# EAGLE design Mi2 (EAGLE 7.4.0)
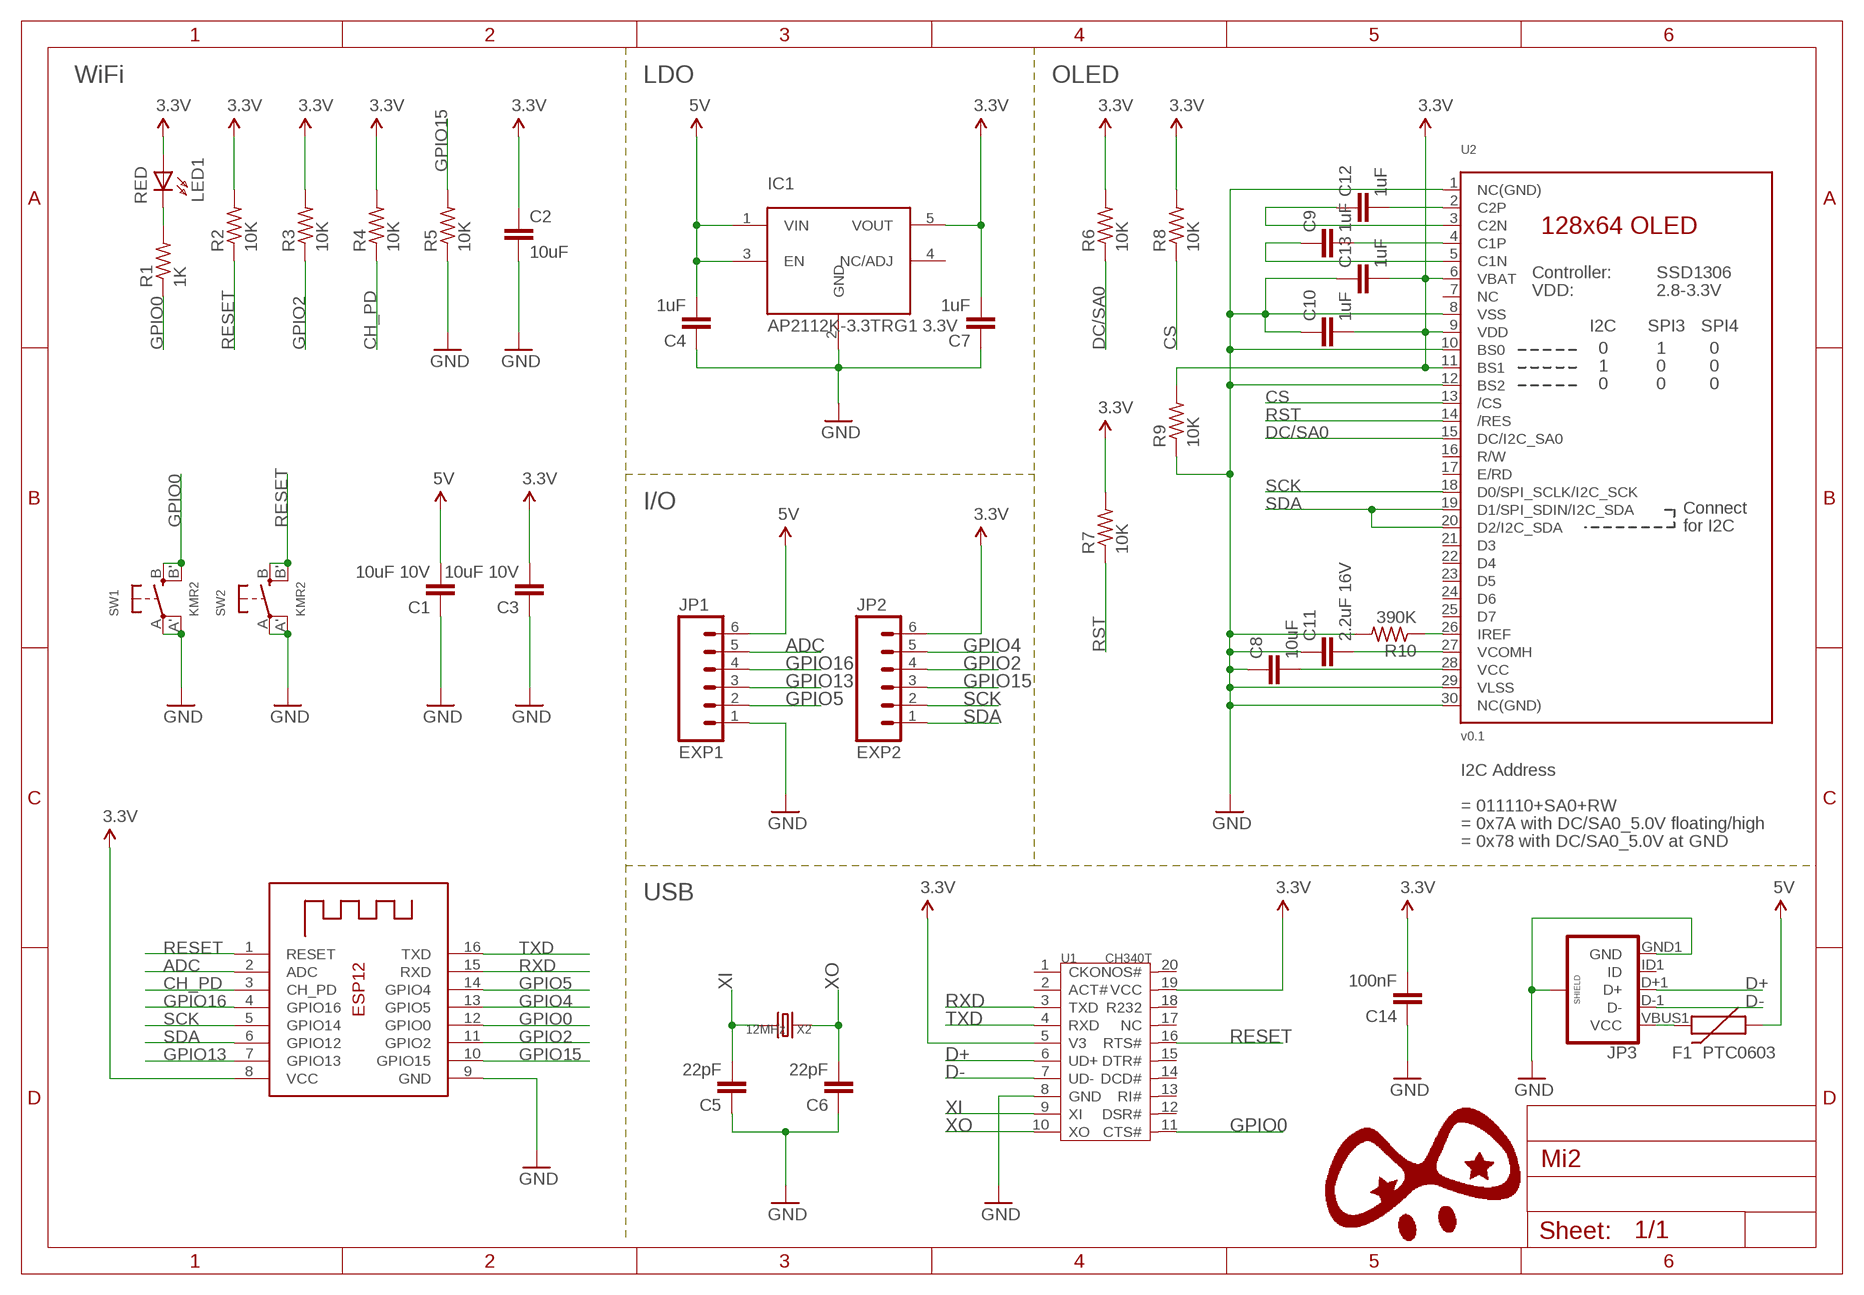
[diagram p0: schematic, sheet 1]

## Parts
C1  10uF 10V  CAP0402-CAP  [0402-CAP]
C2  10uF  10UF-6.3V-20%(0603)  [0603-CAP]
C3  10uF 10V  CAP0402-CAP  [0402-CAP]
C4  1uF  CAP0402-CAP  [0402-CAP]
C5  22pF  CAP0402-CAP  [0402-CAP]
C6  22pF  CAP0402-CAP  [0402-CAP]
C7  1uF  CAP0402-CAP  [0402-CAP]
C8  10uF  10UF-6.3V-20%(0603)  [0603-CAP]
C9  1uF  10UF-6.3V-20%(0603)  [0603-CAP]
C10  1uF  10UF-6.3V-20%(0603)  [0603-CAP]
C11  2.2uF 16V  10UF-6.3V-20%(0603)  [0603-CAP]
C12  1uF  10UF-6.3V-20%(0603)  [0603-CAP]
C13  1uF  10UF-6.3V-20%(0603)  [0603-CAP]
C14  100nF  CAP0402-CAP  [0402-CAP]
F1  PTC0603  [0603]
IC1  AP2112K-3.3TRG1 3.3V  5PIN_REG  [SOT23-5]
JP1  EXP1  M06LOCK  [1X06_LOCK]
JP2  EXP2  M06LOCK  [1X06_LOCK]
JP3  USB_MICROB_PLUGCONN-11752  [USB-B-MICRO-SMD_V03]
LED1  RED  LED0603DWS_L  [LED-0603_L]
R1  1K  R-US_R0402  [R0402]
R2  10K  R-US_R0402  [R0402]
R3  10K  R-US_R0402  [R0402]
R4  10K  R-US_R0402  [R0402]
R5  10K  R-US_R0402  [R0402]
R6  10K  R-US_R0402  [R0402]
R7  10K  R-US_R0402  [R0402]
R8  10K  R-US_R0402  [R0402]
R9  10K  R-US_R0402  [R0402]
R10  390K  R-US_R0402  [R0402]
SW1  KMR2  SWITCH_TACT_SMT4.6X2.8  [BTN_KMR2_4.6X2.8]
SW2  KMR2  SWITCH_TACT_SMT4.6X2.8  [BTN_KMR2_4.6X2.8]
U1  CH340T  [SSOP20]
U2  v0.1  DISP_OLED_UG-2864HSWEG010.96"  [UG-2864HSWEG01_0.96IN_WRAPAROUND]
X1  ESP-12  [ESP-12]
X2  12MHz  CRYSTAL'5032'  [2P-SMD-5X3.2]

## Nets
3.3V: C2.1 C3.2 C7.2 C10.2 C13.2 C14.2 IC1.5(VOUT) JP2.6 LED1.A R2.2 R3.2 R4.2 R6.2 R7.2 R8.2 R9.2 U1.5(V3) U1.19(VCC) U2.6(VBAT) U2.9(VDD) U2.11(BS1) X1.8(VCC)
5V: C1.2 C4.2 F1.1 IC1.1(VIN) IC1.3(EN) JP1.6
ADC: JP1.5 X1.2(ADC)
CH_PD: R4.1 X1.3(CH_PD)
CS: R8.1 U2.13(/CS)
D+: JP3.D+1(D+) U1.6(UD+)
D-: JP3.D-1(D-) U1.7(UD-)
DC/SA0: R6.1 U2.15(DC/I2C_SA0)
GND: C1.1 C2.2 C3.1 C4.1 C5.1 C6.1 C7.1 C8.1 C10.1 C11.1 C13.1 C14.1 IC1.2(GND) JP1.1 JP3.GND1(GND) JP3.SHIELD1(SHIELD) JP3.SHIELD2(SHIELD) JP3.SHIELD3(SHIELD) R5.1 R9.1 R10.2 SW1.A'(P1) SW1.A(P) SW2.A'(P1) SW2.A(P) U1.8(GND) U2.1(NC(GND)) U2.8(VSS) U2.10(BS0) U2.12(BS2) U2.29(VLSS) U2.30(NC(GND)) X1.9(GND)
GPIO0: R1.1 SW1.B'(S1) SW1.B(S) U1.11(CTS#) X1.12(GPIO0)
GPIO2: JP2.4 R3.1 X1.11(GPIO2)
GPIO4: JP2.5 X1.13(GPIO5)
GPIO5: JP1.2 X1.14(GPIO4)
GPIO13: JP1.3 X1.7(GPIO13)
GPIO15: JP2.3 R5.2 X1.10(GPIO15)
GPIO16: JP1.4 X1.4(GPIO16)
N$2: LED1.C R1.2
N$3: R10.1 U2.26(IREF)
N$4: C12.2 U2.2(C2P)
N$5: C12.1 U2.3(C2N)
N$6: C9.2 U2.4(C1P)
N$7: C9.1 U2.5(C1N)
N$11: C8.2 U2.28(VCC)
N$12: C11.2 U2.27(VCOMH)
N$14: F1.2 JP3.VBUS1(VCC)
RESET: R2.1 SW2.B'(S1) SW2.B(S) U1.16(RTS#) X1.1(RESET)
RST: R7.1 U2.14(/RES)
RXD: U1.3(TXD) X1.15(RXD)
SCK: JP2.2 U2.18(D0/SPI_SCLK/I2C_SCK) X1.5(GPIO14)
SDA: JP2.1 U2.19(D1/SPI_SDIN/I2C_SDA) U2.20(D2/I2C_SDA) X1.6(GPIO12)
TXD: U1.4(RXD) X1.16(TXD)
XI: C5.2 U1.9(XI) X2.2
XO: C6.2 U1.10(XO) X2.1
Unconnected: IC1.4(NC/ADJ) JP3.ID1(ID) U1.1(CKO) U1.2(ACT#) U1.12(DSR#) U1.13(RI#) U1.14(DCD#) U1.15(DTR#) U1.17(NC) U1.18(R232) U1.20(NOS#) U2.7(NC) U2.16(R/W) U2.17(E/RD) U2.21(D3) U2.22(D4) U2.23(D5) U2.24(D6) U2.25(D7)

## Notes on the sheet
- WiFi | LDO | OLED
- I/O
- I2C Address
- = 011110+SA0+RW
- = 0x7A with DC/SA0_5.0V floating/high
- = 0x78 with DC/SA0_5.0V at GND
- USB

## Library data of the parts
C1 C3-C7 C14 = SparkFun-Passives:CAP: Capacitor Standard 0603 ceramic capacitor, and 0.1" leaded capacitor.
C2 C8 = SparkFun-Capacitors:10UF-6.3V-20%(0603): CAP-11015; PROD_ID: CAP-11015
C9-C13 = SparkFun-Capacitors:10UF-6.3V-20%(0603): CAP-11015; PROD_ID: CAP-11015; VALUE: 10uF
F1 = SparkFun-PowerIC:PTC: Resettable Fuse PTC Resettable Fuse. Spark Fun Electronics SKU : COM-08357
IC1 = GHI:5PIN_REG
JP1 JP2 = SparkFun-Connectors:M06: Header 6 Standard 6-pin 0.1" header. Use with straight break away headers (SKU : PRT-00116), right angle break away headers (PRT-00553), swiss pins (PRT-00743), machine pins (PRT-00117), and female headers (PRT-00115). Molex polarized connector foot print use with SKU : PRT-08094 with associated crimp pins and housings. NOTES ON THE VARIANTS LOCK and LOCK_LONGPADS... This footprint was designed to help hold the alignment of a through-hole component (i.e. 6-pin header) while soldering it into place. You may notice that each hole has been shifted either up or down by 0.005 of an inch from it's more standard position (which is a perfectly straight line). This slight alteration caused the pins (the squares in the middle) to touch the edges of the holes. Because they are alternating, it causes a "brace" to hold the component in place. 0.005 has proven to be the perfect amount of "off-center" position when using our standard breakaway headers. Although looks a little odd when you look at the bare footprint, once you have a header in there, the alteration is very hard to notice. Also,if you push a header all the way into place, it is covered up entirely on the bottom side. This idea of altering the position of holes to aid alignment will be further integrated into the Sparkfun Library for other footprints. It can help hold any component with 3 or more connection pins.
JP3 = SparkFun-Connectors:USB_MICROB_PLUG: USB Micro-B connectors Some male, some female. Watch your step!; PROD_ID: CONN-11752
LED1 = DOUBLE-SIDE:LED
R1-R10 = resistor:R-US_: RESISTOR, American symbol
SW1 SW2 = microbuilder:SWITCH_TACT_SMT: SMT Tact Switches 6x6mm - Digikey: P12940SCT-ND KMR2 (4.6x2.8mm) - Digikey: 401-1426-1-ND EVQ-PQHB55 - Light Touch, 160GF (4.5x4.5mm) - Digikey: P8090SCT-ND KMT0 - KMT021 NGJ LHS (etc.) IP68/Waterproof - Digikey: CKN10289CT-ND
U1 = template:CH340T
U2 = microbuilder:DISP_OLED_UG-2864HSWEG01: UG-2864HSWEG01 OLED display Both 1.3" and 0.96" models share the same FPC tab footprint, only the screen dimensions vary.
X1 = microbuilder:ESP-12
X2 = Discrete:CRYSTAL*: CRYSTAL

## Net classes
2 pwr2: width 0.508 mm, clearance 0.205 mm

## Board
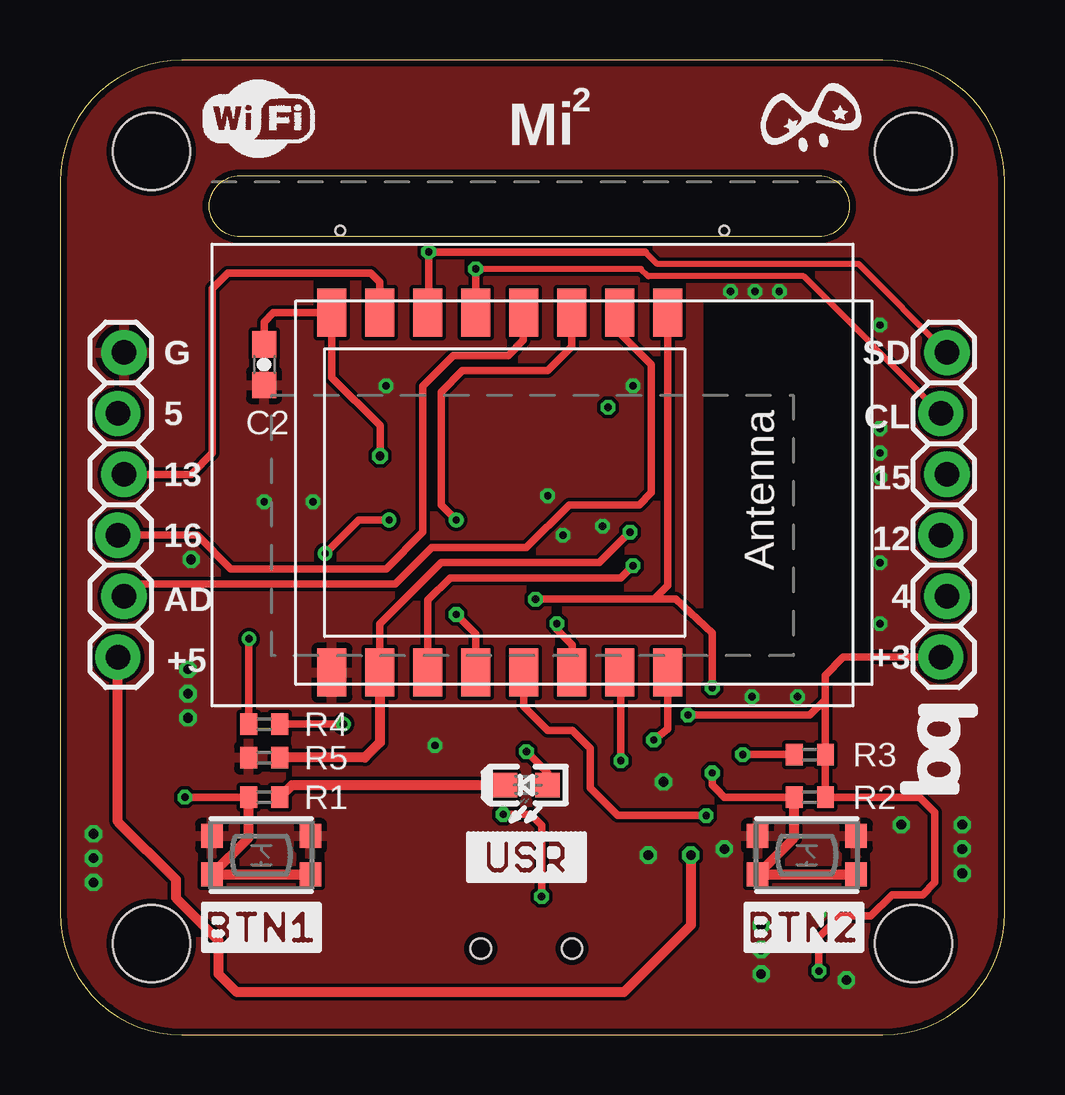
[diagram p1: board, top side]
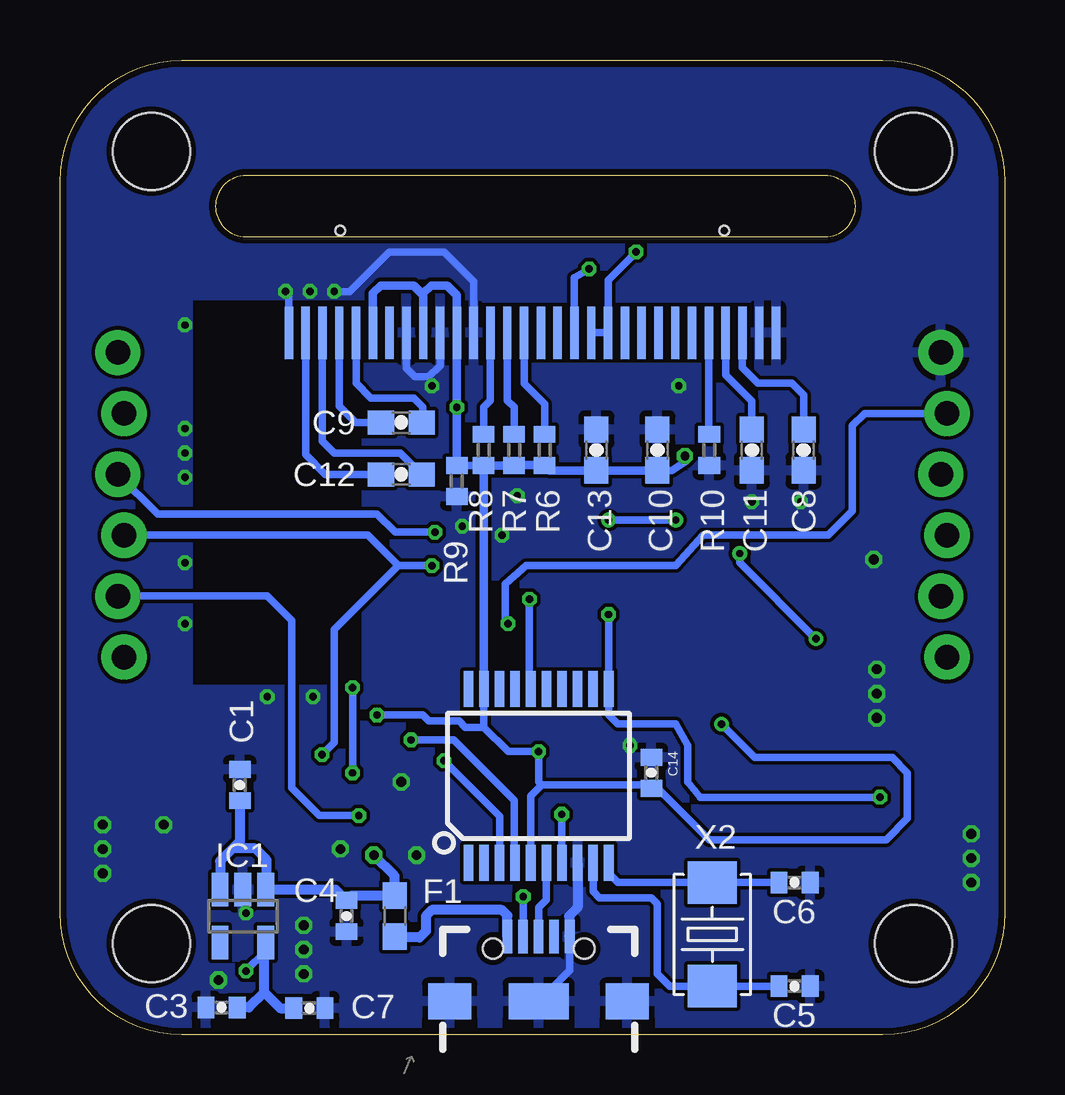
[diagram p2: board, bottom side, seen from below]

Size 39.37 x 40.64 mm. Coordinates in mm from the lower left corner, seen from the top.
Outline: 0,5.08 arc90 5.08,0 34.29,0 arc90 39.37,5.08 39.37,35.56 arc90 34.29,40.64 5.08,40.64 arc90 0,35.56 0,5.08
Outline: 6.22,34.54 arc-90 7.49,35.81 31.62,35.81 arc-90 32.89,34.54 arc-90 31.62,33.27 7.49,33.27 arc-90 6.22,34.54
Copper layers (1*16): Top 0.035mm / dielectric 1.5mm / Bottom 0.035mm
Design rules "pighixxx_CAM_DRC_V1.0": minimum track width 6mil, minimum drill 12mil, track to track 6mil, track to pad 6mil, pad to pad 6mil, via to via 6mil, smd to smd 0mil, copper to edge 10mil, drill to drill 10mil, minimum pad ring 10mil, minimum via ring 6mil, stop-mask expansion 2mil, vias tented up to drill 100mil, thermal gap 10mil
Holes 3.2 mm at 3.81,36.83 35.56,36.83 35.56,3.81 3.81,3.81

### Footprints (pad centres in the part's own frame; a part is rotated, then mirrored left to right if it is on the bottom)
0402-CAP = smd 0.7 x 0.9: 1 -0.65,0; 2 0.65,0
0603-CAP = smd 1.1 x 1: 1 -0.85,0; 2 0.85,0
0603 = smd 1.1 x 1: 1 -0.85,0; 2 0.85,0
SOT23-5 = smd 0.7 x 1.4: 1 0.95,1.1; 2 0,1.1; 3 -0.95,1.1; 4 -0.95,-1.1; 5 0.95,-1.1
1X06_LOCK = drill 1.016 pad 1.88: 1 0,0; 2 2.54,-0.254; 3 5.08,0; 4 7.62,-0.254; 5 10.16,0; 6 12.7,-0.254
USB-B-MICRO-SMD_V03 = smd 1.4 x 0.4: D+1 2.7,0; D-1 2.7,0.65; GND1 2.7,-1.3; ID1 2.7,-0.65; VBUS1 2.7,1.3 | smd 1.5 x 1.8: SHIELD1 0,3.7; SHIELD2 0,-3.7 | smd 1.5 x 2.5: SHIELD3 0,0 | hole 0.85: 2.2,1.9; 2.2,-1.9
LED-0603_L = smd 1.016 x 1.016: A 0.889,0; C -0.889,0
R0402 = smd 0.7 x 0.9: 1 -0.65,0; 2 0.65,0
BTN_KMR2_4.6X2.8 = smd 0.9 x 1: A 2.05,0.8; A' -2.05,0.8; B 2.05,-0.8; B' -2.05,-0.8
SSOP20 = smd 0.4 x 1.5: 1 -2.925,-3.625; 2 -2.275,-3.625; 3 -1.625,-3.625; 4 -0.975,-3.625; 5 -0.325,-3.625; 6 0.325,-3.625; 7 0.975,-3.625; 8 1.625,-3.625; 9 2.275,-3.625; 10 2.925,-3.625; 11 2.925,3.625; 12 2.275,3.625; 13 1.625,3.625; 14 0.975,3.625; 15 0.325,3.625; 16 -0.325,3.625; 17 -0.975,3.625; 18 -1.625,3.625; 19 -2.275,3.625; 20 -2.925,3.625
UG-2864HSWEG01_0.96IN_WRAPAROUND = smd 0.35 x 2.2 bottom: 1 -10.15,-1.2; 2 -9.45,-1.2; 3 -8.75,-1.2; 4 -8.05,-1.2; 5 -7.35,-1.2; 6 -6.65,-1.2; 7 -5.95,-1.2; 8 -5.25,-1.2; 9 -4.55,-1.2; 10 -3.85,-1.2; 11 -3.15,-1.2; 12 -2.45,-1.2; 13 -1.75,-1.2; 14 -1.05,-1.2; 15 -0.35,-1.2; 16 0.35,-1.2; 17 1.05,-1.2; 18 1.75,-1.2; 19 2.45,-1.2; 20 3.15,-1.2; 21 3.85,-1.2; 22 4.55,-1.2; 23 5.25,-1.2; 24 5.95,-1.2; 25 6.65,-1.2; 26 7.35,-1.2; 27 8.05,-1.2; 28 8.75,-1.2; 29 9.45,-1.2; 30 10.15,-1.2 | hole 0.4: -8,-5.45; 8,-5.45
ESP-12 = smd 2 x 1.2: 1 -7.5,4.5; 2 -7.5,2.5; 3 -7.5,0.5; 4 -7.5,-1.5; 5 -7.5,-3.5; 6 -7.5,-5.5; 7 -7.5,-7.5; 8 -7.5,-9.5; 9 7.5,-9.5; 10 7.5,-7.5; 11 7.5,-5.5; 12 7.5,-3.5; 13 7.5,-1.5; 14 7.5,0.5; 15 7.5,2.5; 16 7.5,4.5
2P-SMD-5X3.2 = smd 1.778 x 2.032: 1 -2.159,0; 2 2.159,0

### Placement (x,y rotation side)
C1  31.88,10.41 270 bottom
C2  8.51,27.94 270 top
C3  32.64,1.14 0 bottom
C4  27.43,4.95 90 bottom
C5  8.76,2.03 180 bottom
C6  8.76,6.35 180 bottom
C7  28.98,1.12 180 bottom
C8  8.38,24.38 90 bottom
C9  25.15,25.53 180 bottom
C10  14.48,24.38 270 bottom
C11  10.54,24.38 90 bottom
C12  25.15,23.37 180 bottom
C13  17.02,24.38 270 bottom
C14  14.73,10.92 270 bottom
F1  25.43,4.95 270 bottom
IC1  31.75,4.95 0 bottom
JP1  2.67,28.45 270 top
JP2  36.96,28.45 270 top
JP3  19.43,1.4 90 bottom
LED1  19.43,10.41 0 top
R1  8.51,9.91 0 top
R2  31.24,9.91 0 top
R3  31.24,11.68 0 top
R4  8.51,12.95 0 top
R5  8.51,11.56 0 top
R6  19.18,24.38 270 bottom
R7  20.45,24.38 270 bottom
R8  21.72,24.38 270 bottom
R9  22.83,23.09 90 bottom
R10  12.32,24.38 270 bottom
SW1  8.38,7.49 0 top
SW2  31.11,7.49 0 top
U1  19.43,10.79 0 bottom
U2  19.68,28.07 180 top
U$1  [PIGHIXXX_LOGO]  29.21,36.83 0 top
U$2  [BQ_LOGO_MEDIUM]  38.23,10.03 90 top
U$3  [S_WIFI]  5.97,36.58 0 top
U$4  [S_BTN1]  5.97,5.46 270 top
U$5  [S_BTN2]  28.57,5.46 270 top
U$6  [S_USR]  17.02,8.38 270 top
X1  20.83,22.61 270 top
X2  12.19,4.19 270 bottom

### Tracks (layer width: path | path; a pad name or v marks a point on that pad's centre or on a via)
3.3V  (via drill 0.3, 0.36)
  Top 0.305: LED1.A 20.32,10.92 v19.43,11.81 | X1.8 8.89,30.1 8.51,29.72 C2.1 | JP2.6 32.64,15.75 31.88,14.99 31.88,13.97 | 31.88,13.97 31.88,11.7 R3.2 R2.2 35.81,9.91 36.45,9.27 36.45,6.35 35.94,5.84 34.67,5.84 33.78,4.95 32.51,4.95 31.62,4.06 v31.62,2.67 | v26.16,13.34 31.24,13.34 31.88,13.97 | 11.33,29.44 11.33,27.41 13.34,25.4 v13.34,24.13 | R4.2 v11.81,12.95
  Top 0.356: X1.8 11.33,29.44
  Bottom 0.305: U1.5 19.76,9.96 19.3,10.41 | 19.3,10.41 14.87,10.41 C14.2 14.46,10.27 12.32,8.13 4.95,8.13 4.06,9.02 4.06,10.92 4.7,11.56 10.41,11.56 v11.81,12.95 | 29.66,1.4 C7.2 | 30.86,3.79 IC1.5 30.8,3.49 v31.62,2.67 | R8.2 R9.2 | 19.3,10.41 19.43,10.54 v19.43,11.81 20.7,11.81 21.72,12.83 | 21.72,12.83 U1.19 21.71,12.84 21.72,12.83 | 21.72,12.83 22.48,12.83 22.73,13.08 24,13.08 24.26,13.34 v26.16,13.34 | C10.2 13.88,23.53 13.34,23.88 v13.34,24.13
  Bottom 0.356: C10.2 C13.2 18.98,23.53 R6.2 19.19,23.75 20.19,23.75 20.21,23.73 R7.2 R8.2 21.71,23.72 U1.19 | U2.6 26.34,30.91 26.01,31.24 24.64,31.24 24.23,30.84 U2.9 24.23,30.91 23.9,31.24 23.24,31.24 22.84,30.84 U2.11 v22.84,26.16 22.84,25.06 R9.2
  Bottom 0.406: 30.86,1.78 30.86,3.79 | 30.86,1.78 31.5,1.14 C3.2 | 30.86,1.78 30.2,1.12 C7.2
5V  (via drill 0.41)
  Top 0.406: v26.29,7.49 26.29,4.57 23.5,1.78 7.37,1.78 6.6,2.54 6.6,3.94 4.83,5.71 4.83,6.48 2.41,8.89 JP1.6
  Bottom 0.406: 32.18,7.77 31.24,7.77 30.76,7.29 30.76,6.09 IC1.1 27.88,6.05 C4.2 27.23,5.8 F1.1 25.43,6.63 v26.29,7.49 | 32.18,7.77 32.7,7.25 IC1.3 | C1.2 31.88,8.08 32.18,7.77
ADC
  Top 0.305: X1.2 23.33,29.25 24.64,27.94 24.64,22.61 24.13,22.1 21.21,22.1 19.43,20.32 15.49,20.32 13.97,18.8 3.17,18.8 JP1.5
CH_PD  (via drill 0.3)
  Top 0.305: X1.3 21.33,28.69 20.32,27.69 16.76,27.69 15.88,26.8 15.88,22.1 v16.51,21.46 | v13.72,21.46 12.45,21.46 v11.05,20.07 | v7.87,16.51 7.87,12.97 R4.1
  Bottom 0.305: v16.51,21.46 v13.72,21.46 | v11.05,20.07 11.05,19.68 v7.87,16.51
CS
  Bottom 0.305: U2.13 21.43,26.44 21.72,26.16 R8.1
D+
  Bottom 0.305: U1.6 19.1,5.64 19.43,5.31 JP3.D+1
  Bottom 0.356: U1.6
D-  (via drill 0.3)
  Top 0.305: v18.47,9.2 19.61,9.2 20.07,8.74 v20.07,5.77
  Bottom 0.305: U1.7 v18.47,9.2 | v20.07,5.77 20.07,4.11 JP3.D-1
  Bottom 0.356: U1.7
DC/SA0
  Bottom 0.305: U2.15 20.04,27.15 19.18,26.29 R6.1
GND  (via drill 0.3, 0.41)
  Bottom 0.305: JP3.GND1 18.13,2.7 JP3.SHIELD3 | U2.10 23.54,27.9 24,27.43 24.59,27.43 24.94,27.79 24.94,29.26 U2.8 | U2.1 29.84,30.99 v29.97,30.99 | U2.12 22.14,31.41 23.37,32.64 25.65,32.64 27.3,30.99 v27.94,30.99
  Bottom 0.406: U1.8 17.81,5.31 18.16,4.95 18.16,4.13 JP3.GND1
  other vias: 27.69,7.75 29.21,4.57 32.77,2.29 29.21,2.54 28.96,30.99 23.88,27.05 34.16,25.27 34.16,24.26 34.16,23.24 34.16,29.59 34.16,19.68 34.16,17.14 29.21,3.56 35.05,8.76 37.59,8.76 37.59,7.75 37.59,6.73 25.15,10.54 24.51,7.49 30.73,14.1 28.83,14.1 31.62,5.08 5.33,15.24 5.33,14.22 5.33,13.21 1.4,8.38 1.4,7.37 1.4,6.35 5.46,19.81 20.32,22.48 20.95,20.83 22.61,21.21 13.59,27.05 8.51,22.23 10.54,22.23 15.62,12.06
  pour Top: -0.76,33.27 -0.76,-0.64 20.57,-0.64 40.13,-0.64 40.13,40.77 -0.76,40.77 -0.76,33.53
  pour Bottom: -0.64,38.48 -0.64,-0.64 40.13,-0.64 40.13,40.89 14.1,40.89 -0.64,40.89 -0.64,38.73
GPIO0  (via drill 0.3)
  Top 0.305: v16.51,17.53 17.33,16.71 X1.12 | v5.21,9.91 R1.1
  Top 0.406: SW1.B SW1.B' 7.86,8.22 R1.1
  Bottom 0.305: v16.51,17.53 U1.11 16.51,13.33 16.13,12.95 13.72,12.95 13.21,12.06 13.21,10.54 12.7,9.91 v5.21,9.91
GPIO2  (via drill 0.3)
  Top 0.305: X1.11 15.33,18.12 16.26,19.05 23.37,19.05 v23.88,19.56 | v28.45,11.68 R3.1
  Bottom 0.305: v23.88,19.56 25.27,19.56 | 25.27,19.56 27.94,16.89 27.94,12.19 v28.45,11.68 | JP2.4 26.54,20.83 25.27,19.56
GPIO4  (via drill 0.3)
  Top 0.305: X1.13 19.33,13.69 20.32,12.7 21.34,12.7 22.1,11.94 22.1,10.29 23.24,9.14 v26.92,9.14
  Bottom 0.305: v26.92,9.14 28.57,9.14 29.72,10.29 29.72,17.27 30.73,18.29 JP2.5
GPIO5  (via drill 0.3)
  Top 0.305: v20.7,17.14 20.7,16.89 21.34,16.26 X1.14
  Bottom 0.305: JP1.2 5.84,25.91 6.35,25.4 6.35,21.84 7.37,20.83 12.57,20.83 13.72,19.56 19.94,19.56 20.83,18.8 20.83,17.27 v20.7,17.14
GPIO13
  Top 0.305: X1.7 13.33,31.38 12.95,31.75 6.99,31.75 6.35,31.11 6.35,24.26 5.46,23.37 JP1.3
GPIO15  (via drill 0.3)
  Top 0.305: X1.10 13.33,17.14 15.88,19.68 22.48,19.68 v23.75,20.95
  Top 0.406: X1.10 13.33,12.19 12.7,11.56 R5.2
  Bottom 0.305: v23.75,20.95 25.4,20.95 26.16,21.72 35.31,21.72 JP2.3
GPIO16
  Top 0.305: JP1.4 5.71,20.83 7.11,19.43 13.59,19.43 15.11,20.95 15.11,27.05 16.38,28.32 18.67,28.32 19.3,28.96 19.3,30.08 X1.4
N$2
  Top 0.406: R1.2 9.67,10.41 LED1.C
N$3
  Bottom 0.305: U2.26 12.34,25.05 R10.1
N$4
  Bottom 0.305: U2.2 29.14,24.18 28.32,23.37 C12.2
N$5
  Bottom 0.305: U2.3 28.43,24.75 27.94,24.26 25.18,24.26 C12.1
N$6
  Bottom 0.305: U2.4 27.73,26.21 27.05,25.53 C9.2
N$7
  Bottom 0.305: U2.5 27.04,27.16 26.42,26.54 24.64,26.54 24.26,26.16 24.26,25.57 C9.1
N$11
  Bottom 0.305: U2.28 10.94,27.83 10.29,27.18 8.89,27.18 8.38,26.67 C8.2
N$12
  Bottom 0.305: U2.27 11.63,27.51 10.54,26.42 C11.2
N$14
  Bottom 0.305: 25.39,4.06 F1.2
  Bottom 0.406: JP3.VBUS1 20.73,4.98 20.95,5.21 23.88,5.21 24.13,4.95 24.13,4.32 24.38,4.06 25.39,4.06
RESET  (via drill 0.3)
  Top 0.305: 24.77,18.16 25.33,18.72 X1.1 | R2.1 27.69,9.91 27.37,10.22 27.18,10.41 v27.18,10.92 | 24.77,18.16 25.65,18.16 27.18,16.76 v27.18,14.48 | 24.77,18.16 v19.81,18.16
  Top 0.406: SW2.B SW2.B' 30.59,8.22 R2.1
  Bottom 0.305: U1.16 19.81,14.48 v19.81,18.16 | v27.18,14.48 v27.18,10.92
RST
  Bottom 0.305: U2.14 20.73,26.45 20.45,26.16 R7.1
RXD  (via drill 0.3)
  Top 0.305: X1.15 23.37,15.07 v23.37,11.43
  Bottom 0.305: v23.37,11.43 21.06,9.12 U1.3
SCK  (via drill 0.3)
  Top 0.254: JP2.2 30.99,31.62 24.51,31.62 24.21,31.93 v17.32,31.93
  Top 0.305: X1.5 v17.33,31.92 v17.32,31.93
  Bottom 0.305: U2.18 17.93,31.57 v17.32,31.93
SDA  (via drill 0.3)
  Top 0.254: JP2.1 33.27,32.13 24.89,32.13 24.38,32.64
  Top 0.305: X1.6 15.37,30.14 v15.37,32.64 24.38,32.64
  Bottom 0.305: U2.19 U2.20 16.54,31.47 v15.37,32.64
TXD  (via drill 0.3)
  Top 0.305: v24.74,12.29 25.33,12.76 X1.16
  Bottom 0.305: v24.74,12.29 22.96,12.29 20.45,9.78 20.45,7.21 U1.4
XI
  Bottom 0.305: U1.9 17.16,5.98 16.89,5.71 14.73,5.71 14.48,5.46 14.48,2.54 13.97,2.03 X2.2 C5.2
XO
  Bottom 0.305: U1.10 16.51,6.73 16.13,6.35 X2.1 C6.2

### Text on the board
tNames: 2 | Mi | G | SD | 5 | CL | 13 | 15 | 16 | 12 | AD | 4 | +5 | +3